# EAGLE schematic 7-Seg jumper (EAGLE 6.5.0)
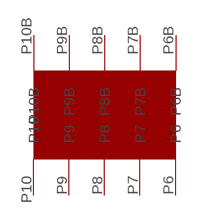
[diagram p0: schematic, sheet 1]

## Parts
U$1  LED_JUMPER  [LED_JUMPER]
Unconnected: U$1.P6 U$1.P6B U$1.P7 U$1.P7B U$1.P8 U$1.P8B U$1.P9 U$1.P9B U$1.P10 U$1.P10B

## Library data of the parts
U$1 = Parts:LED_JUMPER